# Altium schematic sheet XL-1608UGC-041_XL-1608UGC-04.schdoc
size 127 x 101 mm
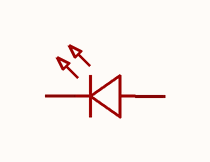
[diagram p0: XL-1608UGC-041_XL-1608UGC-04.schdoc]

## Parts
LED?  XL-1608UGC-04  [LED0603-RD_GREEN]  (value not drawn)

## Nets

Not connected (* = marked no-connect by the designer): LED? 1(K) 2(A)

## Library data of the parts
LED? = XL-1608UGC-04: Manufacturer: XINGLIGHT(成兴光); Add into BOM: yes; Illumination Color: 翠绿色; Voltage - Forward(Vf): 3.3V; Power(Watts): 70mW; Forward Current: 20mA; Wavelength - Dominant: 515nm~535nm; Peak Wavelength: 525nm; Diode Configuration: 独立二极管; Lens Color: 无色透明透镜; Luminous Intensity: 810mcd; Viewing Angle: 120°; Symbol: XL-1608UGC-04; Device: XL-1608UGC-04; LCSC Part Name: XL-1608UGC-04; Supplier Part: C965804; Manufacturer Part: XL-1608UGC-04; Supplier Footprint: 0603; JLCPCB Part Class: Extended Part; Datasheet: https://item.szlcsc.com/datasheet/XL-1608UGC-04/1051413.html; Supplier: LCSC; Convert to PCB: yes; Lamp Holder Type: -; Color Temperature: -; Mounting Style: 正贴; Operating Temperature: -